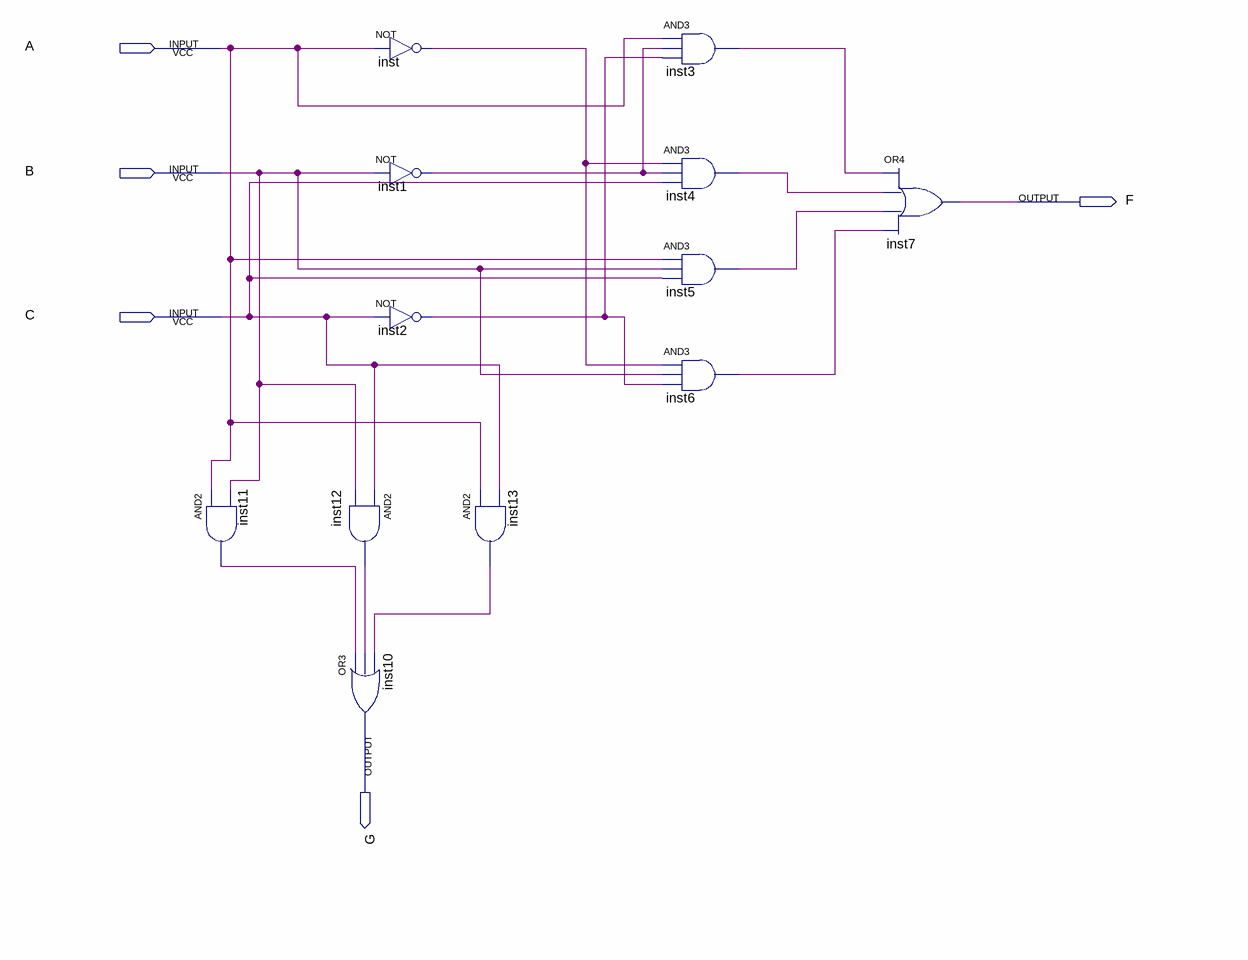
[diagram p0: schematic sheet]
// Quartus schematic Task1.bdf as structural Verilog: 12 symbols, 5 pins
module Task1 (
  input  A,
  input  B,
  input  C,
  output F,
  output G
);

  wire inst1_out, inst2_out, inst3_out, inst4_out, inst5_out, inst6_out, inst11_out, inst12_out, inst13_out,
       inst_out;

  and inst11 (inst11_out, A, B);
  not inst (inst_out, A);
  not inst1 (inst1_out, B);
  not inst2 (inst2_out, C);
  and inst12 (inst12_out, C, B);
  or inst10 (G, inst11_out, inst12_out, inst13_out);
  and inst13 (inst13_out, A, C);
  and inst3 (inst3_out, A, inst1_out, inst2_out);
  and inst4 (inst4_out, inst_out, inst1_out, C);
  and inst5 (inst5_out, A, B, C);
  and inst6 (inst6_out, inst_out, B, inst2_out);
  or inst7 (F, inst3_out, inst4_out, inst5_out, inst6_out);
endmodule
